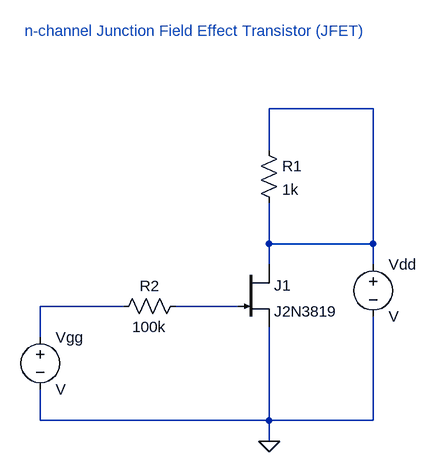
[diagram p0: schematic 2EEB_VELASCO_EXPT8.asc]
2EEB_VELASCO_EXPT8.asc, the LTspice schematic file:
Version 4
SHEET 1 880 680
WIRE 288 -16 128 -16
WIRE 128 48 128 -16
WIRE 128 192 128 128
WIRE 288 192 288 -16
WIRE 288 192 128 192
WIRE 128 224 128 192
WIRE 288 224 288 192
WIRE -96 288 -224 288
WIRE 80 288 -16 288
WIRE -224 336 -224 288
WIRE -224 464 -224 416
WIRE 128 464 128 320
WIRE 128 464 -224 464
WIRE 288 464 288 304
WIRE 288 464 128 464
WIRE 128 496 128 464
FLAG 128 496 0
SYMBOL res 112 32 R0
SYMATTR InstName R1
SYMATTR Value 1k
SYMBOL njf 80 224 R0
SYMATTR InstName J1
SYMATTR Value J2N3819
SYMBOL res 0 272 R90
WINDOW 0 0 56 VBottom 2
WINDOW 3 32 56 VTop 2
SYMATTR InstName R2
SYMATTR Value 100k
SYMBOL voltage 288 208 R0
SYMATTR InstName Vdd
SYMBOL voltage -224 320 R0
SYMATTR InstName Vgg
TEXT -248 -136 Left 2 ;n-channel Junction Field Effect Transistor (JFET)

The netlist it stands for:
* 2EEB_VELASCO_EXPT8.asc
R1 N001 N001 1k
J1 N001 N003 0 J2N3819
R2 N003 N002 100k
Vdd N001 0 V
Vgg N002 0 V
.model NJF NJF
.model PJF PJF
.lib standard.jft
* n-channel Junction Field Effect Transistor (JFET)
.backanno
.end